# EAGLE design dummy-load (EAGLE 9.6.2)
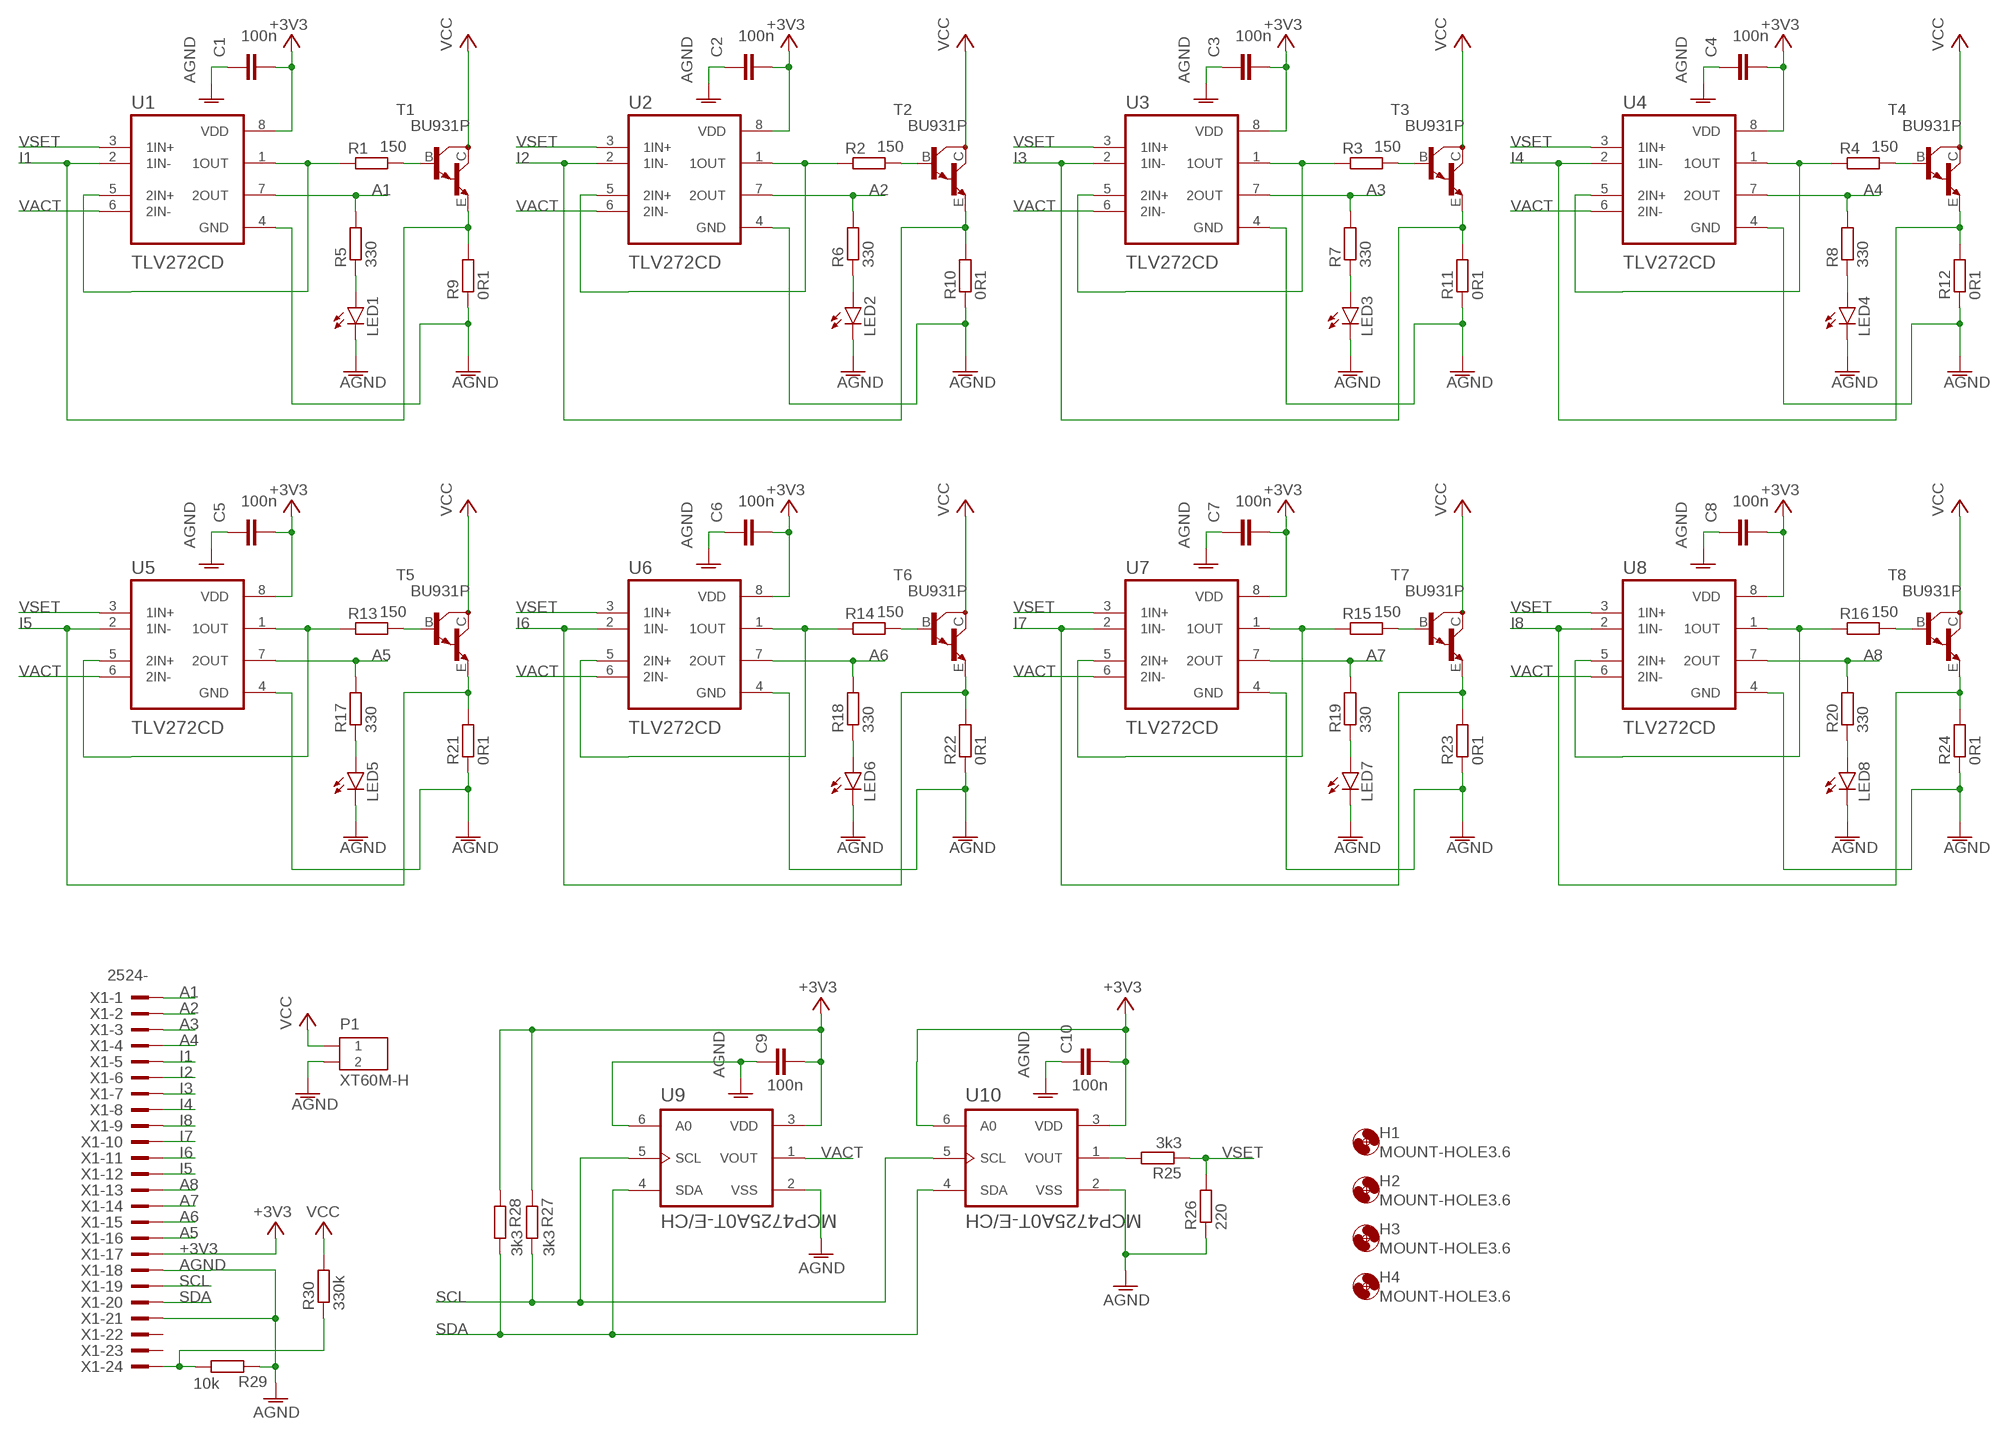
[diagram p0: schematic, sheet 1]

## Parts
C1  100n  C-EUC0805  [C0805]
C2  100n  C-EUC0805  [C0805]
C3  100n  C-EUC0805  [C0805]
C4  100n  C-EUC0805  [C0805]
C5  100n  C-EUC0805  [C0805]
C6  100n  C-EUC0805  [C0805]
C7  100n  C-EUC0805  [C0805]
C8  100n  C-EUC0805  [C0805]
C9  100n  C-EUC0805  [C0805]
C10  100n  C-EUC0805  [C0805]
H1  MOUNT-HOLE3.6  [3,6]
H2  MOUNT-HOLE3.6  [3,6]
H3  MOUNT-HOLE3.6  [3,6]
H4  MOUNT-HOLE3.6  [3,6]
LED1  LEDCHIP-LED0603  [CHIP-LED0603]
LED2  LEDCHIP-LED0603  [CHIP-LED0603]
LED3  LEDCHIP-LED0603  [CHIP-LED0603]
LED4  LEDCHIP-LED0603  [CHIP-LED0603]
LED5  LEDCHIP-LED0603  [CHIP-LED0603]
LED6  LEDCHIP-LED0603  [CHIP-LED0603]
LED7  LEDCHIP-LED0603  [CHIP-LED0603]
LED8  LEDCHIP-LED0603  [CHIP-LED0603]
P1  XT60M-H  [XT60M-H]
R1  150  R-EU_R0805  [R0805]
R2  150  R-EU_R0805  [R0805]
R3  150  R-EU_R0805  [R0805]
R4  150  R-EU_R0805  [R0805]
R5  330  R-EU_R0805  [R0805]
R6  330  R-EU_R0805  [R0805]
R7  330  R-EU_R0805  [R0805]
R8  330  R-EU_R0805  [R0805]
R9  0R1  R-EU_R2512  [R2512]
R10  0R1  R-EU_R2512  [R2512]
R11  0R1  R-EU_R2512  [R2512]
R12  0R1  R-EU_R2512  [R2512]
R13  150  R-EU_R0805  [R0805]
R14  150  R-EU_R0805  [R0805]
R15  150  R-EU_R0805  [R0805]
R16  150  R-EU_R0805  [R0805]
R17  330  R-EU_R0805  [R0805]
R18  330  R-EU_R0805  [R0805]
R19  330  R-EU_R0805  [R0805]
R20  330  R-EU_R0805  [R0805]
R21  0R1  R-EU_R2512  [R2512]
R22  0R1  R-EU_R2512  [R2512]
R23  0R1  R-EU_R2512  [R2512]
R24  0R1  R-EU_R2512  [R2512]
R25  3k3  R-EU_R0805  [R0805]
R26  220  R-EU_R0805  [R0805]
R27  3k3  R-EU_R0805  [R0805]
R28  3k3  R-EU_R0805  [R0805]
R29  10k  R-EU_R0805  [R0805]
R30  330k  R-EU_R0805  [R0805]
T1  BU931P  [TO-247-H]
T2  BU931P  [TO-247-H]
T3  BU931P  [TO-247-H]
T4  BU931P  [TO-247-H]
T5  BU931P  [TO-247-H]
T6  BU931P  [TO-247-H]
T7  BU931P  [TO-247-H]
T8  BU931P  [TO-247-H]
U1  TLV272CD  [SOIC127P599X175-8N]
U2  TLV272CD  [SOIC127P599X175-8N]
U3  TLV272CD  [SOIC127P599X175-8N]
U4  TLV272CD  [SOIC127P599X175-8N]
U5  TLV272CD  [SOIC127P599X175-8N]
U6  TLV272CD  [SOIC127P599X175-8N]
U7  TLV272CD  [SOIC127P599X175-8N]
U8  TLV272CD  [SOIC127P599X175-8N]
U9  MCP4725A0T-E/CH  [SOT95P270X145-6N]
U10  MCP4725A0T-E/CH  [SOT95P270X145-6N]
X1  2524-  [PAK100/2500-24]

## Nets
+3V3: C1.2 C2.2 C3.2 C4.2 C5.2 C6.2 C7.2 C8.2 C9.2 C10.2 R27.1 R28.1 U1.8(VDD) U2.8(VDD) U3.8(VDD) U4.8(VDD) U5.8(VDD) U6.8(VDD) U7.8(VDD) U8.8(VDD) U9.3(VDD) U10.3(VDD) U10.6(A0) X1.17
A1: R5.2 U1.7(2OUT) X1.1
A2: R6.2 U2.7(2OUT) X1.2
A3: R7.2 U3.7(2OUT) X1.3
A4: R8.2 U4.7(2OUT) X1.4
A5: R17.2 U5.7(2OUT) X1.16
A6: R18.2 U6.7(2OUT) X1.15
A7: R19.2 U7.7(2OUT) X1.14
A8: R20.2 U8.7(2OUT) X1.13
AGND: C1.1 C2.1 C3.1 C4.1 C5.1 C6.1 C7.1 C8.1 C9.1 C10.1 LED1.C LED2.C LED3.C LED4.C LED5.C LED6.C LED7.C LED8.C P1.- R9.1 R10.1 R11.1 R12.1 R21.1 R22.1 R23.1 R24.1 R26.1 R29.1 U1.4(GND) U2.4(GND) U3.4(GND) U4.4(GND) U5.4(GND) U6.4(GND) U7.4(GND) U8.4(GND) U9.2(VSS) U9.6(A0) U10.2(VSS) X1.18 X1.21
I1: R9.2 T1.E U1.2(1IN-) X1.5
I2: R10.2 T2.E U2.2(1IN-) X1.6
I3: R11.2 T3.E U3.2(1IN-) X1.7
I4: R12.2 T4.E U4.2(1IN-) X1.8
I5: R21.2 T5.E U5.2(1IN-) X1.12
I6: R22.2 T6.E U6.2(1IN-) X1.11
I7: R23.2 T7.E U7.2(1IN-) X1.10
I8: R24.2 T8.E U8.2(1IN-) X1.9
N$1: R29.2 R30.1 X1.24
N$2: LED5.A R17.1
N$3: LED6.A R18.1
N$5: R14.2 T6.B
N$6: R14.1 U6.1(1OUT) U6.5(2IN+)
N$7: LED7.A R19.1
N$9: R15.2 T7.B
N$10: R13.2 T5.B
N$11: R13.1 U5.1(1OUT) U5.5(2IN+)
N$12: R15.1 U7.1(1OUT) U7.5(2IN+)
N$13: LED8.A R20.1
N$15: R16.2 T8.B
N$16: R16.1 U8.1(1OUT) U8.5(2IN+)
N$17: LED1.A R5.1
N$19: R1.2 T1.B
N$20: R1.1 U1.1(1OUT) U1.5(2IN+)
N$21: LED2.A R6.1
N$23: R2.2 T2.B
N$24: R2.1 U2.1(1OUT) U2.5(2IN+)
N$25: LED3.A R7.1
N$27: R3.2 T3.B
N$28: R3.1 U3.1(1OUT) U3.5(2IN+)
N$29: LED4.A R8.1
N$31: R4.2 T4.B
N$32: R4.1 U4.1(1OUT) U4.5(2IN+)
N$35: R25.2 U10.1(VOUT)
SCL: R27.2 U9.5(SCL) U10.5(SCL) X1.19
SDA: R28.2 U9.4(SDA) U10.4(SDA) X1.20
VACT: U1.6(2IN-) U2.6(2IN-) U3.6(2IN-) U4.6(2IN-) U5.6(2IN-) U6.6(2IN-) U7.6(2IN-) U8.6(2IN-) U9.1(VOUT)
VCC: P1.+ R30.2 T1.C T2.C T3.C T4.C T5.C T6.C T7.C T8.C
VSET: R25.1 R26.2 U1.3(1IN+) U2.3(1IN+) U3.3(1IN+) U4.3(1IN+) U5.3(1IN+) U6.3(1IN+) U7.3(1IN+) U8.3(1IN+)
Unconnected: X1.22 X1.23

## Library data of the parts
C1-C10 = rcl:C-EU: CAPACITOR, European symbol; SPICEPREFIX: C
H1-H4 = holes:MOUNT-HOLE: MOUNTING HOLE with drill center marker
LED1-LED8 = led:LED: LED OSRAM: - CHIPLED LG R971, LG N971, LY N971, LG Q971, LY Q971, LO R971, LY R971 LH N974, LH R974 LS Q976, LO Q976, LY Q976 LO Q996 - Hyper CHIPLED LW Q18S LB Q993, LB Q99A, LB R99A - SideLED LS A670, LO A670, LY A670, LG A670, LP A670 LB A673, LV A673, LT A673, LW A673 LH A674 LY A675 LS A676, LA A676, LO A676, LY A676, LW A676 LS A679, LY A679, LG A679 - Hyper Micro SIDELED® LS Y876, LA Y876, LO Y876, LY Y876 LT Y87S - SmartLED LW L88C, LW L88S LB L89C, LB L89S, LG L890 LS L89K, LO L89K, LY L89K LS L896, LA L896, LO L896, LY L896 - TOPLED LS T670, LO T670, LY T670, LG T670, LP T670 LSG T670, LSP T670, LSY T670, LOP T670, LYG T670 LG T671, LOG T671, LSG T671 LB T673, LV T673, LT T673, LW T673 LH T674 LS T676, LA T676, LO T676, LY T676, LB T676, LH T676, LSB T676, LW T676 LB T67C, LV T67C, LT T67C, LS T67K, LO T67K, LY T67K, LW E67C LS E67B, LA E67B, LO E67B, LY E67B, LB E67C, LV E67C, LT E67C LW T67C LS T679, LY T679, LG T679 LS T770, LO T770, LY T770, LG T770, LP T770 LB T773, LV T773, LT T773, LW T773 LH T774 LS E675, LA E675, LY E675, LS T675 LS T776, LA T776, LO T776, LY T776, LB T776 LHGB T686 LT T68C, LB T68C - Hyper Mini TOPLED® LB M676 - Mini TOPLED Santana® LG M470 LS M47K, LO M47K, LY M47K Source: http://www.osram.convergy.de LUXEON: - LUMILED® LXK2-PW12-R00, LXK2-PW12-S00, LXK2-PW14-U00, LXK2-PW14-V00 LXK2-PM12-R00, LXK2-PM12-S00, LXK2-PM14-U00 LXK2-PE12-Q00, LXK2-PE12-R00, LXK2-PE12-S00, LXK2-PE14-T00, LXK2-PE14-U00 LXK2-PB12-K00, LXK2-PB12-L00, LXK2-PB12-M00, LXK2-PB14-N00, LXK2-PB14-P00, LXK2-PB14-Q00 LXK2-PR12-L00, LXK2-PR12-M00, LXK2-PR14-Q00, LXK2-PR14-R00 LXK2-PD12-Q00, LXK2-PD12-R00, LXK2-PD12-S00 LXK2-PH12-R00, LXK2-PH12-S00 LXK2-PL12-P00, LXK2-PL12-Q00, LXK2-PL12-R00 Source: www.luxeon.com KINGBRIGHT: KA-3528ASYC Source: www.kingbright.com
P1 = dummy-load:XT60M-H
R1-R30 = rcl:R-EU_: RESISTOR, European symbol; SPICEPREFIX: R
T1-T8 = dummy-load:BU931P
U1-U8 = dummy-load:TLV272CD: Check prices <https://pricing.snapeda.com/parts/TLV272CD/Texas%20Instruments/view-part?ref=eda>; AVAILABILITY: Warning; DESCRIPTION: Dual 16V, 3MHz, 550-uA/ch, rail-to-rail output op amp 8-SOIC 0 to 70; MF: Texas Instruments; MP: TLV272CD; PACKAGE: SOIC-8 Texas Instruments; PRICE: None; PURCHASE-URL: https://pricing.snapeda.com/search/part/TLV272CD/?ref=eda
U9 U10 = dummy-load:MCP4725A0T-E/CH: MCP4725 Series 1 Ch I2C EEPROM Memory 5.5 V 12-Bit D/A Converter SMT - SOT-23-6 Check prices <https://pricing.snapeda.com/parts/MCP4725A0T-E/CH/Microchip%20Technology/view-part?ref=eda>; AVAILABILITY: Warning; DESCRIPTION: 12 Bit Digital to Analog Converter 1 SOT-23-6; MF: Microchip Technology; MP: MCP4725A0T-E/CH; PACKAGE: SOT-23-6 Microchip; PRICE: None; PURCHASE-URL: https://pricing.snapeda.com/search/part/MCP4725A0T-E/CH/?ref=eda
X1 = con-3m:2524-: 3M (TM) Pak 100 4-Wall Header Source: 3M; OC_FARNELL: unknown; OC_NEWARK: unknown

## Board
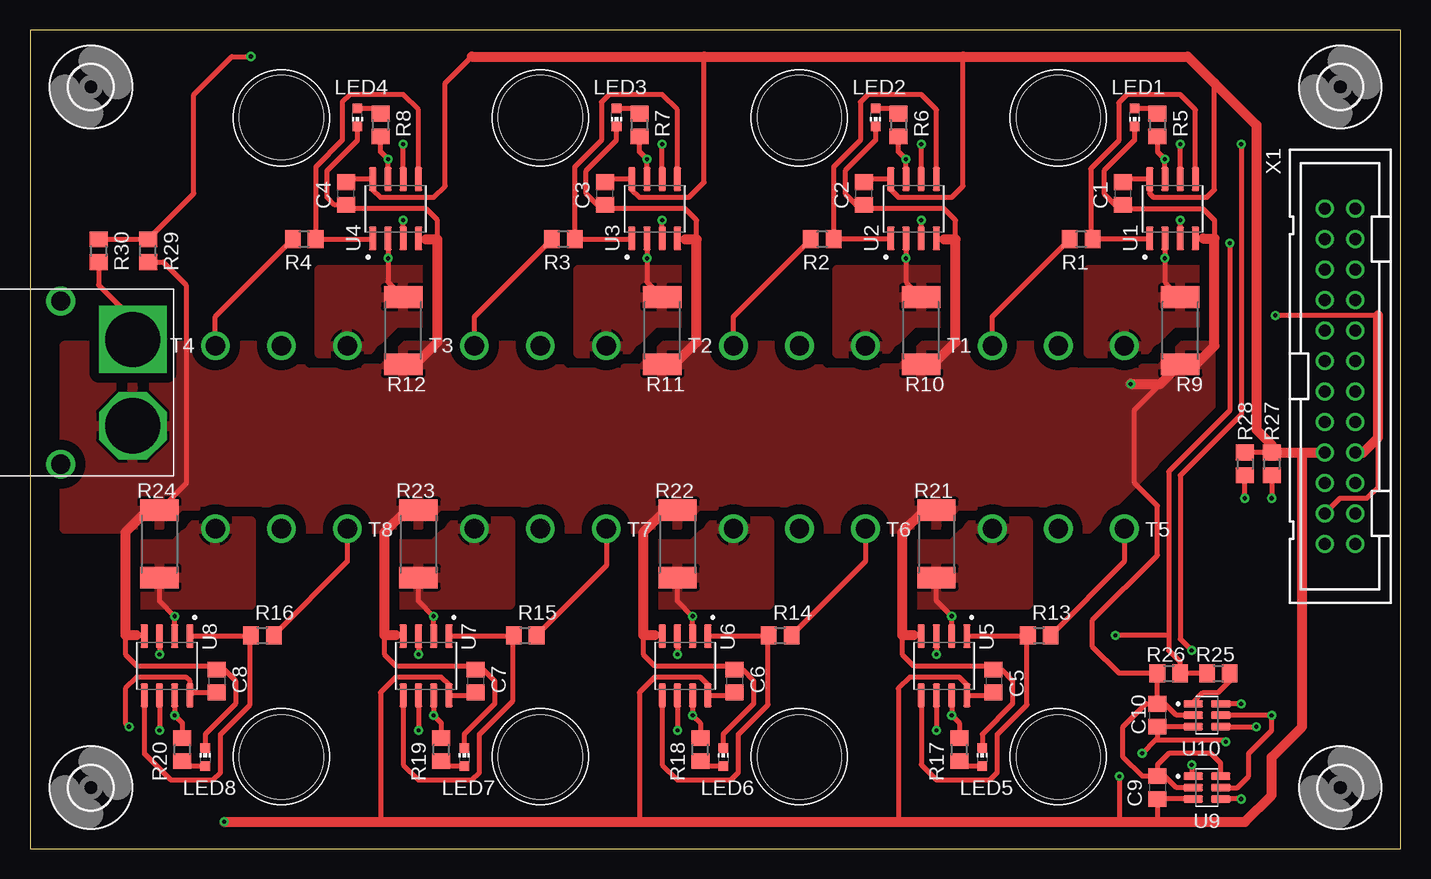
[diagram p1: board, top side]
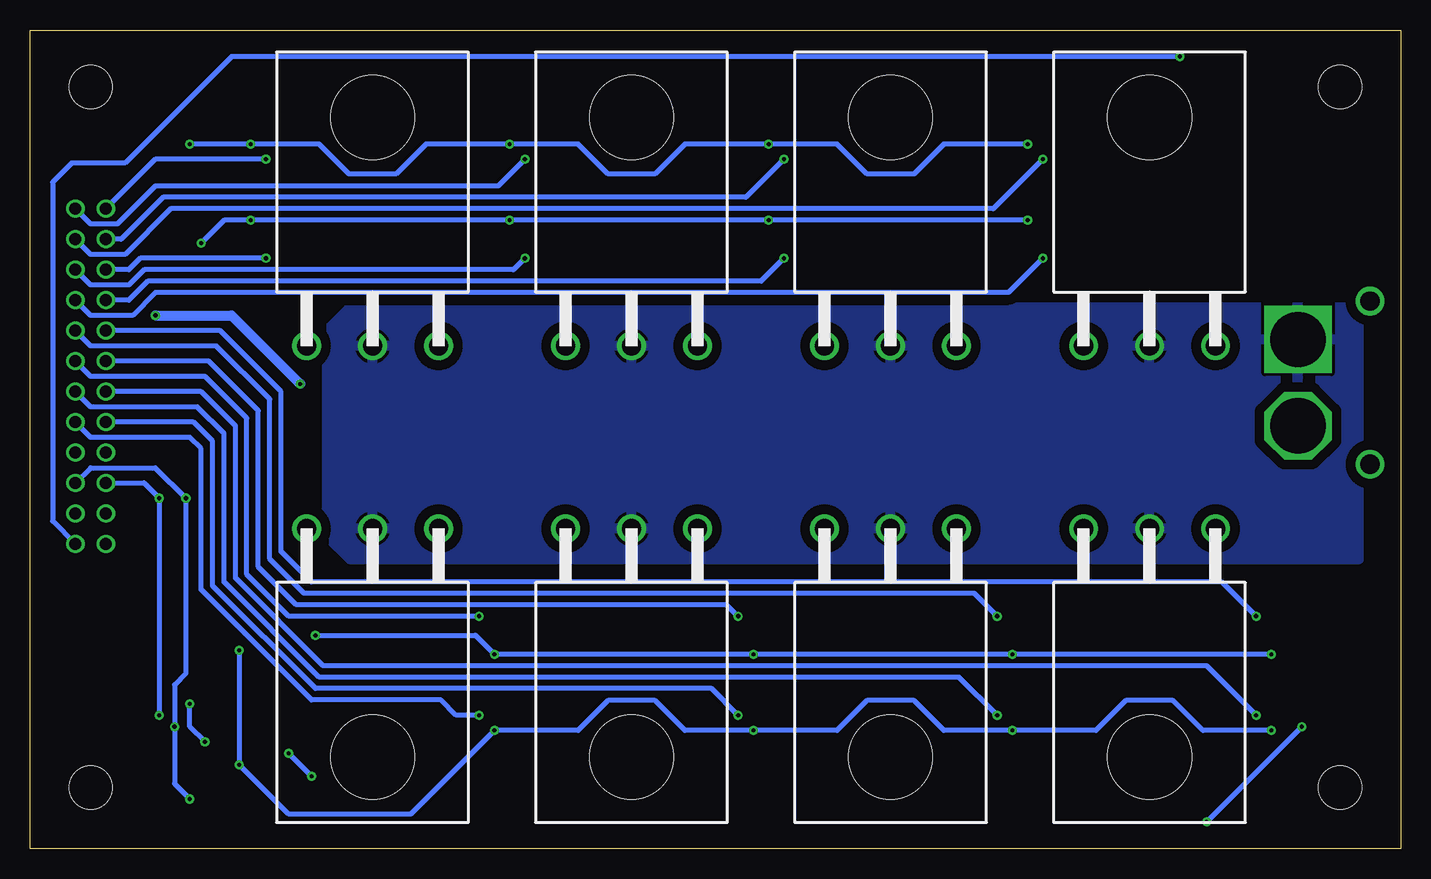
[diagram p2: board, bottom side, seen from below]

Size 114.28 x 68.25 mm. Coordinates in mm from the lower left corner, seen from the top.
Outline: 0,0 114.28,0 114.28,68.25 0,68.25 0,0
Copper layers (1*16): Top 0.035mm / dielectric 1.5mm / Bottom 0.035mm
Design rules "default": minimum track width 6mil, minimum drill 0.35mm, track to track 6mil, track to pad 6mil, pad to pad 6mil, via to via 6mil, smd to smd 6mil, copper to edge 40mil, drill to drill 6mil, minimum pad ring 10mil, minimum via ring 8mil, stop-mask expansion 4mil, vias tented up to drill 0mil, thermal gap 10mil

### Footprints (pad centres in the part's own frame; a part is rotated, then mirrored left to right if it is on the bottom)
C0805 = smd 1.3 x 1.5: 1 -0.95,0; 2 0.95,0
3,6 = hole 3.6: 0,0
CHIP-LED0603 = smd 0.8 x 0.8: A 0,-0.75; C 0,0.75
XT60M-H = drill 4.6 square: + 7.2,0 | drill 4.6 octagon: - 0,0 | drill 1.6: NC@1 -3.2,6; NC@2 10.4,6
R0805 = smd 1.3 x 1.5: 1 -0.95,0; 2 0.95,0
R2512 = smd 1.8 x 3.2: 1 -2.8,0; 2 2.8,0
TO-247-H = drill 1.6: B -5.5,0; C 0,0; E 5.5,0 | hole 7: 0,19.05
SOIC127P599X175-8N = smd 1.97 x 0.6: 1 -2.47,1.905; 2 -2.47,0.635; 3 -2.47,-0.635; 4 -2.47,-1.905; 5 2.47,-1.905; 6 2.47,-0.635; 7 2.47,0.635; 8 2.47,1.905
SOT95P270X145-6N = smd 1.61 x 0.59: 1 -1.145,0.95; 2 -1.145,0; 3 -1.145,-0.95; 4 1.145,-0.95; 5 1.145,0; 6 1.145,0.95
PAK100/2500-24 = drill 1 pad 1.422: 1 -13.97,-1.27; 2 -13.97,1.27; 3 -11.43,-1.27; 4 -11.43,1.27; 5 -8.89,-1.27; 6 -8.89,1.27; 7 -6.35,-1.27; 8 -6.35,1.27; 9 -3.81,-1.27; 10 -3.81,1.27; 11 -1.27,-1.27; 12 -1.27,1.27; 13 1.27,-1.27; 14 1.27,1.27; 15 3.81,-1.27; 16 3.81,1.27; 17 6.35,-1.27; 18 6.35,1.27; 19 8.89,-1.27; 20 8.89,1.27; 21 11.43,-1.27; 22 11.43,1.27; 23 13.97,-1.27; 24 13.97,1.27

### Placement (x,y rotation side)
C1  91.12,54.61 90 top
C2  69.53,54.61 90 top
C3  47.94,54.61 90 top
C4  26.35,54.61 90 top
C5  80.33,13.97 270 top
C6  58.74,13.97 270 top
C7  37.15,13.97 270 top
C8  15.56,13.97 270 top
C9  93.98,5.08 270 top
C10  93.98,11.11 270 top
H1  5.08,63.5 0 top
H2  5.08,5.08 0 top
H3  109.22,5.08 0 top
H4  109.22,63.5 0 top
LED1  92.08,60.96 180 top
LED2  70.48,60.96 180 top
LED3  48.9,60.96 180 top
LED4  27.3,60.96 180 top
LED5  79.38,7.62 0 top
LED6  57.78,7.62 0 top
LED7  36.2,7.62 0 top
LED8  14.61,7.62 0 top
P1  8.57,35.24 90 top
R1  87.63,50.8 180 top
R2  66.04,50.8 180 top
R3  44.45,50.8 180 top
R4  22.86,50.8 180 top
R5  93.98,60.33 270 top
R6  72.39,60.33 270 top
R7  50.8,60.33 270 top
R8  29.21,60.33 270 top
R9  95.89,43.18 90 top
R10  74.3,43.18 90 top
R11  52.7,43.18 90 top
R12  31.11,43.18 90 top
R13  84.14,17.78 0 top
R14  62.55,17.78 0 top
R15  41.27,17.78 0 top
R16  19.37,17.78 0 top
R17  77.47,8.26 90 top
R18  55.88,8.26 90 top
R19  34.29,8.26 90 top
R20  12.7,8.26 90 top
R21  75.56,25.4 270 top
R22  53.98,25.4 270 top
R23  32.38,25.4 270 top
R24  10.79,25.4 270 top
R25  99.06,14.61 0 top
R26  94.93,14.61 0 top
R27  103.5,32.07 270 top
R28  101.28,32.07 270 top
R29  9.84,49.85 90 top
R30  5.71,49.85 270 top
T1  85.72,41.91 0 top
T2  64.14,41.91 0 top
T3  42.55,41.91 0 top
T4  20.95,41.91 0 top
T5  85.72,26.67 180 top
T6  64.14,26.67 180 top
T7  42.55,26.67 180 top
T8  20.95,26.67 180 top
U1  95.25,53.34 90 top
U2  73.66,53.34 90 top
U3  52.07,53.34 90 top
U4  30.48,53.34 90 top
U5  76.2,15.24 270 top
U6  54.61,15.24 270 top
U7  33.02,15.24 270 top
U8  11.43,15.24 270 top
U9  98.11,5.08 0 top
U10  98.11,11.11 0 top
X1  109.22,39.37 270 top

### Tracks (layer width: path | path; a pad name or v marks a point on that pad's centre or on a via)
+3V3  (via drill 0.35)
  Top 0.406: C1.2 91.37,55.81 U1.8 93.34,54.61 93.66,54.29 98.11,54.29 98.74,54.93 98.74,63.82 | C2.2 69.78,55.81 U2.8 71.75,54.93 72.39,54.29 76.83,54.29 77.79,55.24 77.79,66.04 | C3.2 48.19,55.81 U3.8 50.16,54.93 50.8,54.29 54.93,54.29 56.2,55.56 56.2,66.04 | C4.2 26.6,55.81 U4.8 28.57,54.93 29.21,54.29 33.66,54.29 34.61,55.24 34.61,63.82 36.83,66.04 | C8.2 13.59,13.02 U8.8 13.34,13.97 13.02,14.29 8.89,14.29 7.94,13.34 7.94,10.48 v8.26,10.16 | C7.2 36.9,12.77 U7.8 34.92,13.65 34.29,14.29 30.48,14.29 29.21,13.02 29.21,2.22 | C6.2 58.49,12.77 U6.8 56.52,13.65 55.88,14.29 52.07,14.29 50.8,13.02 50.8,2.22 | C5.2 80.08,12.77 U5.8 78.11,13.65 77.47,14.29 73.34,14.29 72.39,13.34 72.39,2.22 | U9.3 C9.2 93.98,2.22 | U10.3 C10.2 93.98,9.21 93.82,9.05 | 93.82,9.05 v92.71,7.94 | v90.81,6.03 90.81,2.22 | R27.1 R28.1 | 93.82,9.05 99.54,9.05 v99.69,8.89 | v100.97,12.06 v100.96,12.06 U10.6
  Top 0.813: v16.19,2.22 29.21,2.22 50.8,2.22 72.39,2.22 90.81,2.22 93.98,2.22 101.28,2.22 103.5,4.45 103.5,7.62 106.05,10.16 106.05,33.02 | 36.83,66.04 56.2,66.04 77.79,66.04 96.52,66.04 98.74,63.82 102.23,60.33 102.23,34.92 103.5,33.65 R27.1 106.05,33.02 | 106.05,33.02 X1.17
  Bottom 0.406: v92.71,7.94 v90.81,6.03 | v8.26,10.16 v16.19,2.22 | v99.69,8.89 100.97,10.16 v100.97,12.06
A1  (via drill 0.35)
  Top 0.406: U1.7 v94.61,57.47 93.98,58.1 R5.2
  Bottom 0.406: X1.1 103.82,57.47 v94.61,57.47
A2  (via drill 0.35)
  Top 0.406: U2.7 v73.03,57.47 72.39,58.1 R6.2
  Bottom 0.406: v73.03,57.47 75.25,55.24 103.82,55.24 107,52.07 109.22,52.07 X1.2
A3  (via drill 0.35)
  Top 0.406: U3.7 v51.44,57.47 50.8,58.1 R7.2
  Bottom 0.406: v51.44,57.47 54.61,54.29 103.19,54.29 106.68,50.8 X1.3
A4  (via drill 0.35)
  Top 0.406: U4.7 v29.84,57.47 29.21,58.1 R8.2
  Bottom 0.406: v29.84,57.47 33.97,53.34 102.55,53.34 106.36,49.53 109.22,49.53 X1.4
A5  (via drill 0.35)
  Top 0.406: U5.7 v76.83,11.11 77.47,10.48 R17.2
  Bottom 0.406: v76.83,11.11 78.74,11.11 80.01,12.38 90.81,12.38 100.01,21.59 100.01,33.34 100.97,34.29 109.22,34.29 X1.16
A6  (via drill 0.35)
  Top 0.406: U6.7 v55.24,11.11 55.88,10.48 R18.2
  Bottom 0.406: v55.24,11.11 57.47,13.34 90.49,13.34 99.06,21.91 99.06,33.97 100.65,35.56 X1.15
A7  (via drill 0.35)
  Top 0.406: U7.7 v33.66,11.11 34.29,10.48 R19.2
  Bottom 0.406: v33.66,11.11 36.83,14.29 90.17,14.29 98.11,22.23 98.11,34.61 100.33,36.83 109.22,36.83 X1.14
A8  (via drill 0.35)
  Top 0.406: U8.7 v12.06,11.11 12.7,10.48 R20.2
  Bottom 0.406: v12.06,11.11 16.19,15.24 89.85,15.24 97.16,22.54 97.16,35.24 100.01,38.1 X1.13
AGND  (via drill 0.35)
  Top 0.406: 97.22,50.8 U1.4 97.79,50.87 | C1.1 91.44,53.34 | LED1.C 92.08,59.05 89.53,56.52 89.53,54.61 90.48,53.66 C1.1 | C1.1 91.12,53.34 97.79,53.34 98.74,52.39 98.74,50.87 | U2.4 76.13,50.87 76.2,50.8 | 77.15,50.8 77.15,52.39 76.2,53.34 69.85,53.34 C2.1 68.89,53.66 67.94,54.61 67.94,56.52 70.48,59.05 LED2.C | U4.4 32.95,50.87 33.02,50.8 | U3.4 54.54,50.87 54.61,50.8 | 33.97,50.8 33.97,52.39 33.02,53.34 26.67,53.34 C4.1 25.4,53.66 24.77,54.29 24.77,56.52 27.3,59.05 LED4.C | 55.56,50.8 55.56,52.39 54.61,53.34 48.26,53.34 C3.1 47.3,53.66 46.35,54.61 46.35,56.52 48.9,59.05 LED3.C | U5.4 73.73,17.71 73.66,17.78 | U6.4 52.14,17.71 52.07,17.78 | U7.4 30.55,17.71 30.48,17.78 | U8.4 8.96,17.71 8.89,17.78 | 72.71,17.78 72.71,16.19 73.66,15.24 80.01,15.24 C5.1 80.97,14.92 81.92,13.97 81.92,12.06 79.38,9.53 LED5.C | 51.12,17.78 51.12,16.19 52.07,15.24 58.42,15.24 C6.1 59.38,14.92 60.33,13.97 60.33,12.06 57.78,9.53 LED6.C | 29.53,17.78 29.53,16.19 30.48,15.24 36.83,15.24 C7.1 37.78,14.92 38.73,13.97 38.73,12.06 36.2,9.53 LED7.C | 7.94,17.78 7.94,16.19 8.89,15.24 15.24,15.24 C8.1 16.2,14.92 17.14,13.97 17.14,12.06 14.61,9.53 LED8.C | U9.2 95.57,5.08 94.62,6.03 C9.1 | U10.2 95.57,11.11 94.62,12.06 C10.1 | C9.1 92.71,6.03 91.12,7.62 91.12,10.16 93.03,12.06 C10.1 | C10.1 R26.1 90.81,14.61 88.58,16.83 88.58,19.05 93.98,24.45 93.98,28.57 92.08,30.48 92.08,36.57 95.7,40.19 R9.1 | 112.39,44.45 v103.82,44.45 | U9.6 99.25,7.11 98.42,7.94 94.93,7.94 93.98,6.99 C9.1 | X1.21 109.22,29.21 111.44,29.21 112.39,30.16 112.39,34.29 | R29.1 11.11,48.9 13.02,46.99 13.02,30.42 R24.1
  Top 0.813: 97.79,50.87 98.74,50.87 98.74,41.91 97.21,40.38 R9.1 | R10.1 75.31,40.38 77.15,42.23 77.15,50.8 76.2,50.8 | R11.1 53.72,40.38 55.56,42.23 55.56,50.8 54.61,50.8 | R12.1 32.12,40.38 33.97,42.23 33.97,50.8 33.02,50.8 | R21.1 74.56,28.2 72.71,26.35 72.71,17.78 73.66,17.78 | R22.1 52.97,28.2 51.12,26.35 51.12,17.78 52.07,17.78 | R23.1 31.38,28.2 29.53,26.35 29.53,17.78 30.48,17.78 | R24.1 9.79,28.2 7.94,26.35 7.94,17.78 8.89,17.78 | X1.18 111.12,33.02 112.39,34.29 112.39,44.45 | v91.76,38.73 94.24,38.73 95.7,40.19
  Bottom 0.813: v103.82,44.45 97.47,44.45 v91.76,38.73
  pour Top (isolate 0.813, rank 2): 2.86,26.67 88.27,26.67 98.42,36.83 98.42,41.91 2.86,41.91
I1  (via drill 0.35)
  Top 0.406: R9.2 94.61,47.25 v94.61,49.21 U1.2
  Bottom 0.406: X1.5 106.05,48.26 105.09,49.21 v94.61,49.21
  pour Top (isolate 0.813): 97.47,48.26 97.47,43.81 95.25,43.81 92.71,41.27 88.27,41.27 88.27,48.26
I2  (via drill 0.35)
  Top 0.406: v73.03,49.21 U2.2 73.03,47.25 R10.2
  Bottom 0.406: v73.03,49.21 73.98,48.26 104.78,48.26 106.05,46.99 109.22,46.99 X1.6
  pour Top (isolate 0.813): 75.88,48.26 75.88,43.81 73.66,43.81 71.12,41.27 67.31,41.27 67.31,48.26
I3  (via drill 0.35)
  Top 0.406: U3.2 v51.44,49.21 51.44,47.25 R11.2
  Bottom 0.406: v51.44,49.21 53.34,47.31 104.46,47.31 106.05,45.72 X1.7
  pour Top (isolate 0.813): 54.29,48.26 54.29,43.81 52.07,43.81 49.53,41.27 45.72,41.27 45.72,48.26
I4  (via drill 0.35)
  Top 0.406: U4.2 v29.84,49.21 29.84,47.25 R12.2
  Bottom 0.406: v29.84,49.21 32.7,46.35 103.82,46.35 105.73,44.45 109.22,44.45 X1.8
  pour Top (isolate 0.813): 32.7,48.26 32.7,43.81 30.48,43.81 27.94,41.27 24.13,41.27 24.13,48.26
I5  (via drill 0.35)
  Top 0.406: U5.2 v76.83,19.37 75.56,20.64 R21.2
  Bottom 0.406: X1.12 109.22,39.37 99.69,39.37 96.2,35.88 96.2,22.86 92.71,19.37 v76.83,19.37
  pour Top (isolate 0.813): 83.19,27.3 83.19,20.32 73.98,20.32 73.98,25.4 76.83,25.4 78.74,27.3
I6  (via drill 0.35)
  Top 0.406: U6.2 v55.24,19.37 53.98,20.64 R22.2
  Bottom 0.406: v55.24,19.37 56.2,20.32 92.08,20.32 95.25,23.5 95.25,36.51 99.38,40.64 X1.11
  pour Top (isolate 0.813): 61.59,27.3 61.59,20.32 52.39,20.32 52.39,25.4 55.24,25.4 57.15,27.3
I7  (via drill 0.35)
  Top 0.406: U7.2 v33.66,19.37 32.38,20.64 R23.2
  Bottom 0.406: v33.66,19.37 35.56,21.27 91.44,21.27 94.3,24.13 94.3,37.47 98.74,41.91 109.22,41.91 X1.10
  pour Top (isolate 0.813): 40.01,27.3 40.01,20.32 30.8,20.32 30.8,25.4 33.66,25.4 35.56,27.3
I8  (via drill 0.35)
  Top 0.406: U8.2 v12.06,19.37 10.79,20.64 R24.2
  Bottom 0.406: v12.06,19.37 14.92,22.23 90.81,22.23 93.34,24.77 93.34,38.1 98.42,43.18 X1.9
  pour Top (isolate 0.813): 18.41,27.3 18.41,20.32 9.21,20.32 9.21,25.4 12.06,25.4 13.97,27.3
N$1  (via drill 0.35)
  Top 0.406: R30.1 R29.2 13.65,54.61 13.65,62.87 16.83,66.04 v18.41,66.04
  Bottom 0.406: v18.41,66.04 97.47,66.04 106.36,57.15 110.81,57.15 112.39,55.56 112.39,27.3 X1.24
N$2
  Top 0.406: LED5.A 77.91,6.87 R17.1
N$3
  Top 0.406: LED6.A 56.31,6.87 R18.1
N$5
  Top 0.406: T6.B 69.64,23.92 R14.2
N$6
  Top 0.406: U6.1 61.53,17.71 | 61.53,17.71 R14.1 | U6.5 52.7,6.99 53.98,5.71 58.42,5.71 59.05,6.35 59.05,9.53 61.53,12 61.53,17.71
N$7
  Top 0.406: LED7.A 34.73,6.87 R19.1
N$9
  Top 0.406: T7.B 48.05,23.6 R15.2
N$10
  Top 0.406: T5.B 91.22,23.92 R13.2
N$11
  Top 0.406: U5.1 83.12,17.71 | 83.12,17.71 R13.1 | U5.5 74.3,6.99 75.56,5.71 80.01,5.71 80.64,6.35 80.64,9.53 83.12,12 83.12,17.71
N$12
  Top 0.406: U7.1 40.26,17.71 | 40.26,17.71 R15.1 | U7.5 31.11,6.99 32.38,5.71 36.83,5.71 37.47,6.35 37.47,9.53 40.26,12.31 40.26,17.71
N$13
  Top 0.406: LED8.A 13.13,6.87 R20.1
N$15
  Top 0.406: T8.B 26.45,23.92 R16.2
N$16
  Top 0.406: U8.1 18.35,17.71 | 18.35,17.71 R16.1 | U8.5 9.53,7.94 11.75,5.71 15.24,5.71 15.88,6.35 15.88,9.53 18.35,12 18.35,17.71
N$17
  Top 0.406: LED1.A 93.55,61.71 R5.1
N$19
  Top 0.406: T1.B 80.22,44.34 R1.2
N$20
  Top 0.406: U1.5 97.16,61.59 95.89,62.87 91.44,62.87 90.76,62.19 90.76,59.01 88.43,56.67 88.43,50.95 R1.1 93.28,50.8 U1.1
N$21
  Top 0.406: LED2.A 71.95,61.71 R6.1
N$23
  Top 0.406: T2.B 58.63,44.34 R2.2
N$24
  Top 0.406: U2.1 71.69,50.8 R2.1 67,56.83 69.22,59.05 69.22,62.23 69.85,62.87 74.3,62.87 75.56,61.59 U2.5
N$25
  Top 0.406: LED3.A 50.37,61.71 R7.1
N$27
  Top 0.406: T3.B 37.05,44.34 R3.2
N$28
  Top 0.406: U3.1 50.09,50.8 R3.1 45.4,56.83 47.62,59.05 47.62,62.23 48.26,62.87 52.7,62.87 53.98,61.59 U3.5
N$29
  Top 0.406: LED4.A 28.77,61.71 R8.1
N$31
  Top 0.406: T4.B 15.46,44.34 R4.2
N$32
  Top 0.406: R4.1 | R4.1 28.5,50.8 U4.1 | U4.5 32.38,61.59 31.11,62.87 26.67,62.87 26.04,62.23 26.04,59.05 23.81,56.83 R4.1
N$35
  Top 0.406: U10.1 96.96,12.19 97.79,13.02 99.06,13.02 100.01,13.97 R25.2
SCL  (via drill 0.35)
  Top 0.406: U10.5 v103.5,11.11 103.5,9.84 101.6,7.94 101.6,6.03 100.65,5.08 U9.5 | R27.2 v103.5,29.21
  Bottom 0.406: X1.19 104.78,30.48 v103.5,29.21 v103.5,11.11
SDA  (via drill 0.35)
  Top 0.406: v101.28,29.21 R28.2 | v100.97,4.13 U9.4 | U10.4 v102.23,10.16
  Bottom 0.406: X1.20 109.22,31.75 103.82,31.75 v101.28,29.21 101.28,14.61 102.23,13.65 v102.23,10.16 102.23,5.4 v100.97,4.13
VACT  (via drill 0.35)
  Top 0.406: U1.6 v95.89,58.74 | U2.6 v74.3,58.74 | U3.6 v52.7,58.74 | U4.6 v31.11,58.74 | U5.6 v75.56,9.84 | U6.6 v53.98,9.84 | U7.6 v32.38,9.84 | U8.6 v10.79,9.84 | U9.1 96.84,6.16 v96.84,6.99 | v96.84,16.51 95.89,17.46 95.89,31.11 100.97,36.2 v100.97,58.74
  Bottom 0.406: v10.79,9.84 16.5,9.84 19,12.34 22.91,12.34 25.41,9.84 v32.38,9.84 38.09,9.84 40.59,12.34 44.5,12.34 47,9.84 v53.98,9.84 59.68,9.84 62.18,12.34 66.09,12.34 68.59,9.84 v75.56,9.84 82.55,2.86 92.71,2.86 v96.84,6.99 v96.84,16.51 | v31.11,58.74 38.09,58.74 40.59,56.24 44.5,56.24 47,58.74 v52.7,58.74 59.68,58.74 62.18,56.24 66.09,56.24 68.59,58.74 v74.3,58.74 81.27,58.74 83.77,56.24 87.68,56.24 90.18,58.74 v95.89,58.74 v100.97,58.74
VCC
  Top 0.406: R30.2 5.71,46.99 8.57,44.13 P1.+
  pour Bottom (isolate 0.813): 3.49,45.09 87.63,45.09 89.53,43.18 89.53,26.04 87.63,24.13 3.49,24.13
VSET  (via drill 0.35)
  Top 0.406: U1.3 v95.89,52.39 | U2.3 v74.3,52.39 | U3.3 v52.7,52.39 | U4.3 v31.11,52.39 | U5.3 v75.56,16.19 | U6.3 v53.98,16.19 | U7.3 v32.38,16.19 | U8.3 v10.79,16.19 | R25.1 R26.2 95.88,15.56 94.93,16.51 94.93,17.78 | 94.93,17.78 v90.49,17.78 | v100.01,50.48 100.01,36.51 94.93,31.43 94.93,17.78
  Bottom 0.406: v10.79,16.19 v32.38,16.19 v53.98,16.19 v75.56,16.19 77.15,17.78 v90.49,17.78 | v31.11,52.39 v52.7,52.39 v74.3,52.39 v95.89,52.39 98.11,52.39 v100.01,50.48